# Altium project SoldeerBout.PrjPcb
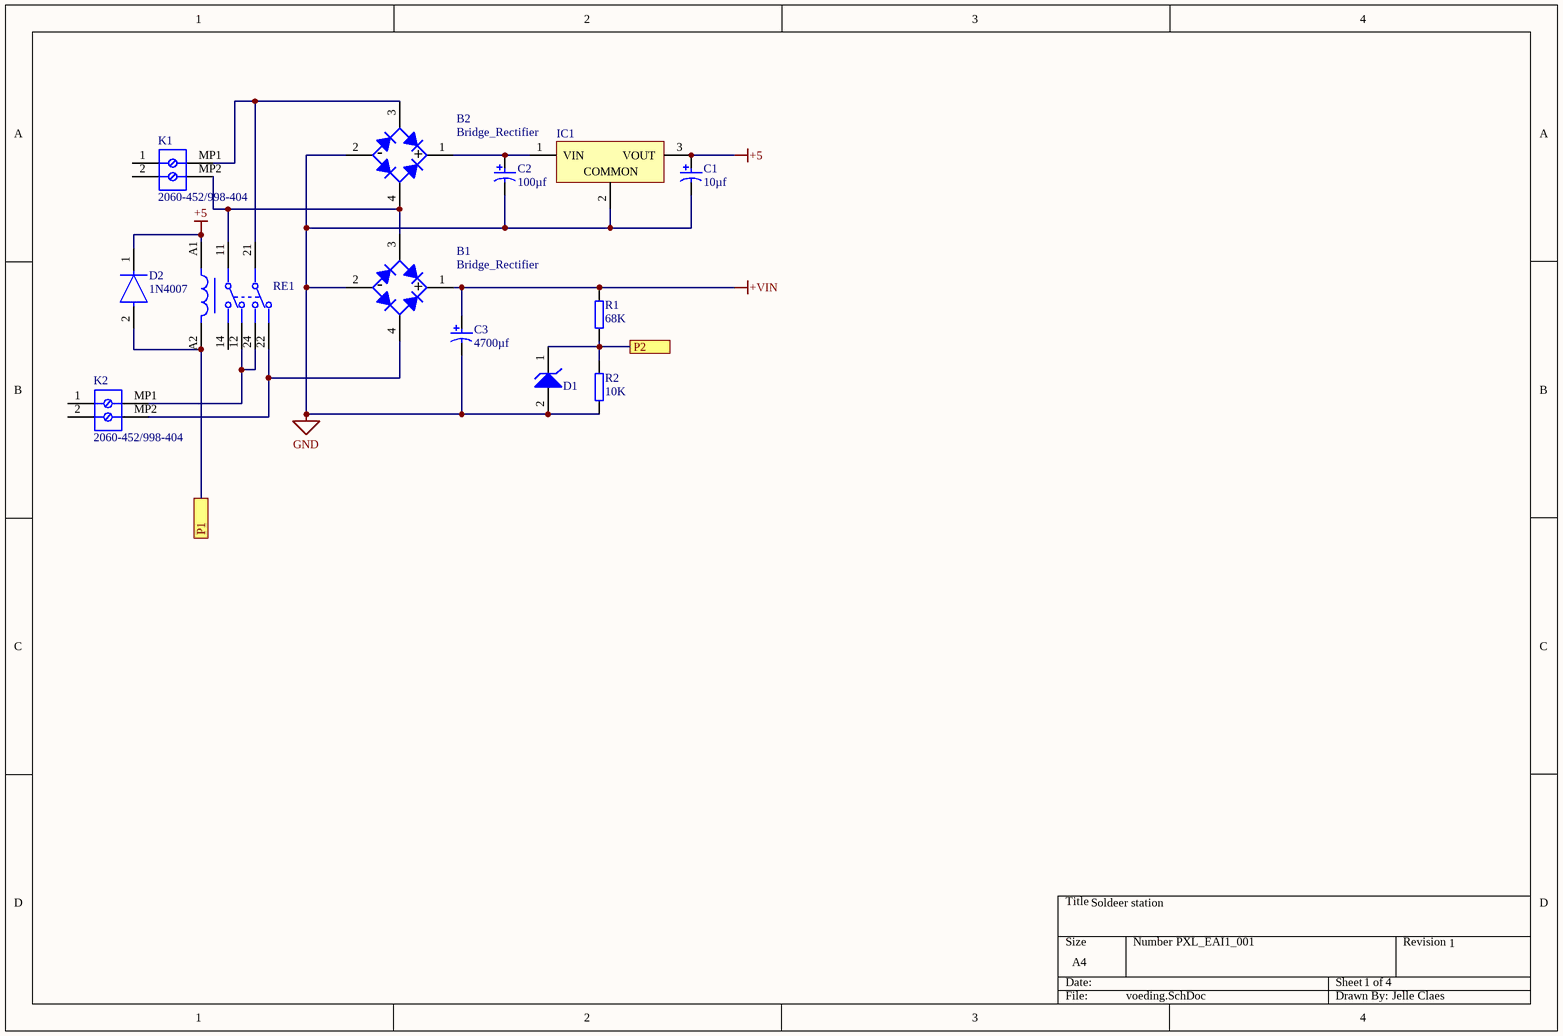
[diagram p0: voeding.SchDoc]
sheetof: =Sheet+'/'+SheetTotal
4 sheets, 64 parts. Net scope: flat (ports and power ports of the same name join across sheets).
Board file: soldeerstation.PcbDoc
Sheets:
  voeding.SchDoc
  PWM.SchDoc
  thermokoppel.SchDoc
  CPU.SchDoc

## Sheet voeding.SchDoc: Soldeer station
size A4; DrawnBy: Jelle Claes; SheetNumber: 1; SheetTotal: 4; Number: PXL_EAI1_001

### Parts
B1  Bridge_Rectifier  [ttf]
B2  Bridge_Rectifier  [ttf]
C1  10µf  [D4L5.4]
C2  100µf  [CE_D8_L10]
C3  4700µf  [CE_D25_L25_plugin]
D1  Zener_Diode  [SOD-123FL]  (value not drawn)
D2  1N4007  [SOD-123FL]
IC1  OKI-78SR-5/1.5-W36-C  [OKI78SR515W36C]  (value not drawn)
K1  2060-452/998-404  [WAGO-2060-452_V]
K2  2060-452/998-404  [WAGO-2060-452_V]
R1  68K  [R_0805_M]
R2  10K  [R_0805_M]
RE1  RELAY_GENERAL_PURPOSE  [RT42]  (value not drawn)

### Ports
P1 (see CPU[1A]), P2 (see CPU[3B])

### Nets
+5: C1.2 D2.1(C) IC1.3(VOUT) RE1.A1
+VIN: B1.1(K) C3.2 R1.2
GND: B1.2(A) B2.2(A) C1.1 C2.1 C3.1 D1.2(A) IC1.2(COMMON) R2.1
NetB1_3: B1.3(C) B2.4(C) K1.MP2 RE1.11
NetB1_4: B1.4(C) K2.MP2 RE1.22
NetB2_1: B2.1(K) C2.2 IC1.1(VIN)
NetB2_3: B2.3(C) K1.MP1 RE1.21
NetD1_1: D1.1(K) R1.1 R2.2 ; port P2
NetD2_2: D2.2(A) RE1.A2 ; port P1
NetK2_MP1: K2.MP1 RE1.12 RE1.24

Not connected (* = marked no-connect by the designer): K1 1 2; K2 1 2; RE1 14

### Notes on the sheet
- 1
- (in symbol Bridge_Rectifier) -; +

### Library data of the parts
B1 B2 = Bridge_Rectifier: Manufacturer: Diodes Inc; Average Rectified Current-Max: 0.8A; Reverse Voltage-Max [Vrrm]: 600V; Forward Voltage: 1V; Peak Current-Max: 30A; Reverse Current-Max: 5µA; Package Version: 05/2016; Package URL: http://www.diodes.com/_files/packages/MiniDIP.pdf; Datasheet Version: Rev. 13-2, 12/2010; Datasheet URL: http://www.diodes.com/_files/datasheets/ds17003.pdf; Mounting Technology: SurfaceMount; Manufacturer URL: http://www.diodes.com/; Package Reference: MiniDIP-4; Package Description: 4-Pin Small Outline Integrated Circuit, Body 4.7 x 3.8 mm, Pitch 2.5 mm
C1-C3 = Capacitor_Electrolytic: Manufacturer: Panasonic; Voltage Rating: 25 V; ComponentLink2URL: http://industrial.panasonic.com/cdbs/www-data/pdf/RDE0000/ABA0000C1181.pdf; Height: 10.2 mm; Max Operating Temperature: 105 degC; PackageReference: EEE-FK1E221P; ComponentLink1Description: Manufacturer URL; ComponentLink1URL: http://www.panasonic.com/; Mount: Surface Mount; REACH SVHC: No SVHC; Min Operating Temperature: -55 degC; ComponentLink2Description: Datasheet; DatasheetVersion: 03/2016; Length: 10.2 mm; RoHSCompliant: true; Packaging: Tape and Reel; Package Quantity: 500; Lead Pitch: 3.1 mm; Pins: 2; PackageDescription: 2-Pin Electrolytic Aluminum Capacitor, Body 8.3 x 8.3 mm; Mounting Technology: Surface Mount
D1 = Zener_Diode: Manufacturer: On Semiconductor; PartNumber: 1SMB5920BT3G; Packing: Tape and Reel; VZ Typ (V): 6.2; PackageDescription: 2-Pin Small Molded Package, J-Bend Lead, Body 4.33 x 3.625 mm; Mounting Technology: Surface Mount; PackageVersion: Rev. H, 05/2011; ComponentLink1Description: Manufacturer URL; RoHS: Pb-Free; DatasheetVersion: Rev. 8; ComponentLink2Description: Datasheet; ComponentLink2URL: http://www.onsemi.com/pub_link/Collateral/1SMB5913BT3-D.PDF; ComponentLink1URL: http://www.onsemi.com/; ComponentLink3Description: Package Specification; PackageReference: SMB-2-403A-03_H; ComponentLink3URL: http://www.onsemi.com/pub_link/Collateral/1SMB5913BT3-D.PDF
D2 = Diode: Manufacturer: Diotec; Max Surge Forward Current: 27A; Forward Current: 1A; Max Junction Temp: +175°C; Reverse Voltage: 1000V; Value: 15pF; Peak Reverse Current: 5uA; Category: Diode; Temperature Range Low: -50°C; Automotive: No; Temperature: -50°C to +175°C; Lead Free: Yes; ComponentLink2Description: Datasheet; Max Repetitive Reverse Voltage: 1000V; ComponentLink2URL: https://datasheet.octopart.com/1N4007-Diotec-datasheet-62346875.pdf; Manufacturer Part Number: 1N4007; Device Class L3: Rectifier Diodes; Height: 2.8mm; Octopart: https://octopart.com/1n4007-diotec-4040411; Package: 1N4007; Temperature Range High: +175°C; Device Class L1: Discrete Semiconductors; Device Class L2: Diodes; RoHS: TRUE; Capacitance: 15pF; Ipc Land Pattern Name: DIOAD888W100L520D280
IC1 = OKI-78SR-5/1.5-W36-C: Non-Isolated DC/DC Converter, 7.5 W, 7 to 36 V, 1.5 A, -40 to 85 degC, 3-Pin THD, RoHS; Manufacturer: Murata; Current - Output (Max): 1.5A; Power (Watts) - Max: 8W; Efficiency: 90.5%; Voltage - Input (Min): 7V; Voltage - Input (Max): 36V; Voltage - Output 1: 5V; Number of Outputs: 1; Package / Case: 3-SIPModule; Features: SCP; Type: LinearRegulatorReplacement; Size / Dimension: 0.41"Lx0.30"Wx0.65"H(10.4mmx7.6mmx16.5mm); Datasheet URL: https://datasheet.ciiva.com/8006/1790439-8006672.pdf; Datasheet Version: Oct-13; Power (Watts) - Manufacture Series: 8W; Voltage - Output 2: -; Series: Okami™OKI-78SR; Family: DCDCConverters; Manufacturer URL: http://www.murata.com/; Category: PowerSupplies-BoardMount; Voltage - Isolation: -; Packaging: Tube; Applications: ITE(Commercial); Mounting Type: ThroughHole; Voltage - Output 3: -; Operating Temperature: -40degC~85degC
K1 K2 = WAGO-2060: Terminal Block, Pitch 4 mm, 1 x 2 Position, Height 4.5 mm, -60 to 105 degC, RoHS, Tape and Reel; Manufacturer: WAGO; Number of contacts: 2; Content: 1pc(s); Min. cross section (flexible): 0.25mm²; Stripping length: 6-7mm; Nominal current: 9A; Nominal voltage: 160V; Pitch: 4mm; Min. cross section (unflexible): 0.2mm²; Max. cross section (inflexible): 0.75mm²; AWG: 24-18; Connection: Pullspring; Type: 2060-452/998-404; Package Reference: 2060-452; Mounting Technology: SurfaceMount; Colour: White; Package Description: Terminal Block, Pitch 4 mm, 1 x 2 Position, Height 4.5 mm; Height: 4.5mm; Manufacturer URL: http://global.wago.com/en/index-en.jsp; Material: PPA-GFenclosure·Tin-platedcoppercontacts; Width: 10.1mm; Manufacturer part No.: 2060-452/998-404; Datasheet URL: http://www.wago.com/infomaterial/pdf/60255126.pdf; Contact material: Tinplated; Length: 7.9mm; Max. cross section (flexible): 0.75mm²; Datasheet Version: 03/2015
R1 R2 = Resistor: Manufacturer: Vishay Dale; Part Number: CRCW08050000Z0EA
RE1 = RELAY_GENERAL_PURPOSE: Manufacturer Part Number: RT424005; Manufacturer: TE Connectivity; Coil Power: 403mW; Throw Configuration: DPDT; Coil Voltage: 5V; Number Of Contacts: 2; Coil Resistance: 62Ω; Current Rating: 8A; Coil Type: Non-Latching; Category: Relay; Octopart: https://octopart.com/5-1393243-9-te+connectivity-41835766; Device Class L3: Power Relays; ComponentLink2URL: https://www.te.com/commerce/DocumentDelivery/DDEController?Action=showdoc&DocId=Data+Sheet%7FRT2%7F1014%7Fpdf%7FEnglish%7FENG_DS_RT2_1014.pdf%7F5-1393243-9; Ambient Temperature Range High: +85°C; ComponentLink2Description: Datasheet; Digikey Description: RELAY GENERAL PURPOSE DPDT 8A 5V; Package: RT424005; Automotive: No; Device Class L1: Electromechanical; Height: 15.7mm; Device Class L2: Relays; Ambient Temperature Range Low: -40°C; Mouser Description: General Purpose Relay, Rt2 Series, Power, Non Latching, Dpdt, 5 Vdc, 8 A Rohs Compliant: Yes; Lead Free: Yes; RoHS: TRUE

## Sheet PWM.SchDoc
size A4; SheetNumber: 2; SheetTotal: 4
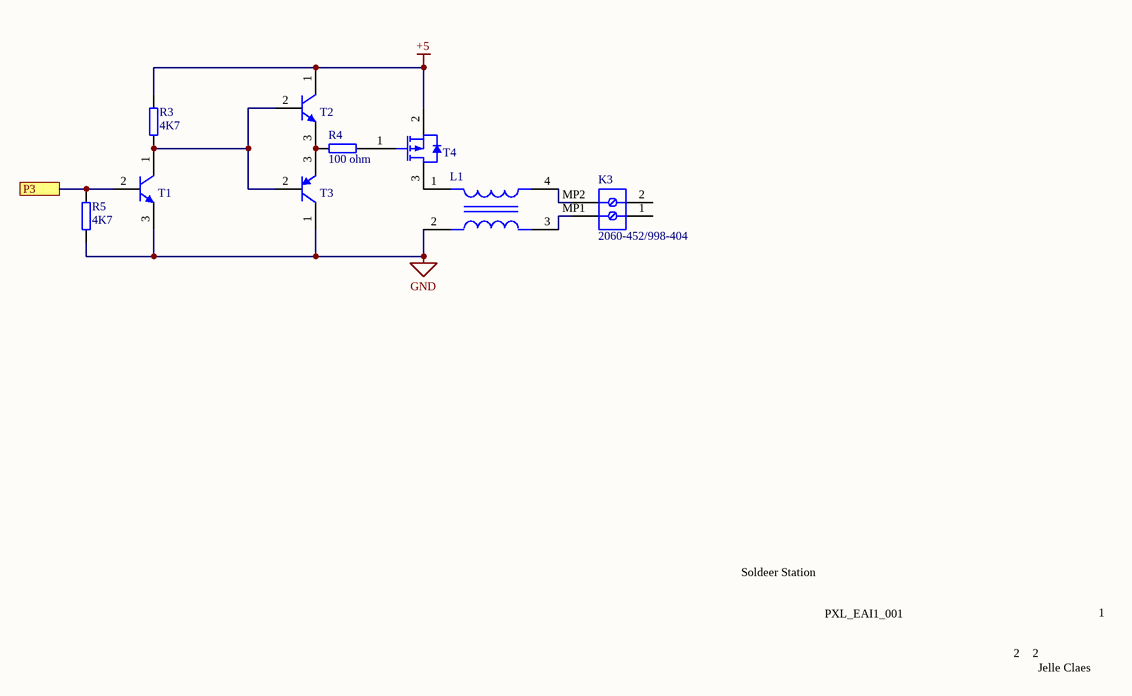
[diagram p1: PWM.SchDoc]

### Parts
K3  2060-452/998-404  [WAGO-2060-452_V]
L1  Common_Mode_Choke  [2545]  (value not drawn)
R3  4K7  [R_0805_M]
R4  100 ohm  [R_0805_M]
R5  4K7  [R_0805_M]
T1  Transistor_NPN  [SOT_23]  (value not drawn)
T2  Transistor_NPN  [SOT_23]  (value not drawn)
T3  Transistor_PNP  [SOT_23]  (value not drawn)
T4  MOSFET_P  [TO_252]  (value not drawn)

### Ports
P3 (see CPU[2B])

### Nets
+5: R3.2 T2.1(C) T4.2(DRAIN)
GND: L1.2 R5.1 T1.3(E) T3.1(C)
NetK3_MP1: K3.MP1 L1.3
NetK3_MP2: K3.MP2 L1.4
NetL1_1: L1.1 T4.3(SOURCE)
NetR3_1: R3.1 T1.1(C) T2.2(B) T3.2(B)
NetR4_1: R4.1 T4.1(GATE)
NetR4_2: R4.2 T2.3(E) T3.3(E)
NetR5_2: R5.2 T1.2(B) ; port P3

Not connected (* = marked no-connect by the designer): K3 1 2

### Notes on the sheet
- Soldeer Station
- PXL_EAI1_001
- 2
- 1
- Jelle Claes

### Library data of the parts
K3 = WAGO-2060: as K1 on sheet voeding; Type: 2060-452/998-404; Package Reference: 2060-452; Mounting Technology: SurfaceMount; Colour: White; Package Description: Terminal Block, Pitch 4 mm, 1 x 2 Position, Height 4.5 mm; Height: 4.5mm; Manufacturer URL: http://global.wago.com/en/index-en.jsp; Material: PPA-GFenclosure·Tin-platedcoppercontacts; Width: 10.1mm; Manufacturer part No.: 2060-452/998-404; Datasheet URL: http://www.wago.com/infomaterial/pdf/60255126.pdf; Contact material: Tinplated; Length: 7.9mm; Max. cross section (flexible): 0.75mm²; Datasheet Version: 03/2015
L1 = Common_Mode_Choke: Max Current Rating: 2A; Number of Lines: 2; Impedance: 900R; Element Configuration: Dual; Insulation Resistance: 10MR; Test Frequency: 100MHz; DC Resistance (DCR): 60mR; Voltage Rating (DC): 50V; Current Rating: 2.3A; Number of Pins: 4; DC Current: 2A; Mount: Surface Mount; Current: 2A; REACH SVHC: No SVHC; Width: 4.5mm; Case/Package: 1808; Voltage Rating: 50V; Package Quantity: 1; Height: 2mm; Max DC Current: 2A; Packaging: Tape and Reel; Max Operating Temperature: 85°C; Lead Free: Lead Free; Length: 0.185inch; Series: ACM; Radiation Hardening: No; Max Voltage Rating (DC): 50V; Termination: Flat; Depth: 4.7mm; RoHS Compliant: Yes; DC Resistance-Max: 60mR; Min Operating Temperature: -40°C
R3-R5 = Resistor: as R1 on sheet voeding
T1 T2 = Transistor_NPN: Manufacturer: On Semiconductor; PartNumber: BC547C; IC Continuous (A): 0.1; fT Min (MHz): 150; Packing: Bulk Box; Polarity: NPN; Mounting Technology: Through Hole; ComponentLink1URL: http://www.onsemi.com/; ComponentLink1Description: Manufacturer URL; ComponentLink3URL: http://www.onsemi.cn/pub_link/Collateral/2N6426-D.PDF; DatasheetVersion: Rev. 7; PackageVersion: Rev. AM; RoHS: FALSE; ComponentLink2URL: http://www.onsemi.com/pub_link/Collateral/BC546-D.PDF; ComponentLink3Description: Package Specification; PackageDescription: 3-Pin Transistor Outline, Body 4.825 x 3.685 mm, Pitch 1.27 mm; PackageReference: TO-92-3-29-11_AM_SL; ComponentLink2Description: Datasheet
T3 = Transistor_PNP: Manufacturer: On Semiconductor; PartNumber: BC557C; Polarity: PNP; IC Continuous (A): -0.1; Packing: Bulk Box; PackageVersion: Rev. AM; RoHS: FALSE; PackageDescription: 3-Pin Transistor Outline, Body 4.825 x 3.685 mm, Pitch 1.27 mm; ComponentLink2Description: Datasheet; DatasheetVersion: Rev. 3; ComponentLink3Description: Package Specification; Mounting Technology: Through Hole; ComponentLink2URL: http://www.onsemi.com/pub_link/Collateral/BC556B-D.PDF; ComponentLink1URL: http://www.onsemi.com/; ComponentLink1Description: Manufacturer URL; ComponentLink3URL: http://www.onsemi.cn/pub_link/Collateral/2N6426-D.PDF; PackageReference: TO-92-3-29-11_AM_SL
T4 = MOSFET_P: Manufacturer: Fairchild Semiconductor; Reel Quantity: 3000; Drain Source Voltage Vds: 20V; Power Dissipation Pd: 500mW; On Resistance Rds(on): 52mohm; Full Power Rating Temperature: 25°C; Voltage Vgs Max: -800mV; Pulse Current Idm: 10A; Rds(on) Test Voltage Vgs: -4.5V; External Depth: 2.5mm; Transistor Case Style: SOT-23; No. of Pins: 3; Continuous Drain Current Id: 2.4A; Voltage Vds Typ: -20V; Voltage Vgs th Max: -1.5V; Transistor Polarity: PChannel; Package Version: Rev. 3, 05/2015; External Width: 3.05mm; External Length / Height: 1.12mm; SMD Marking: 304P; SVHC: NoSVHC(19-Dec-2012); Termination Type: SMD; Datasheet URL: https://www.fairchildsemi.com/datasheets/FD/FDN304P.pdf; Tape Width: 8mm; Mounting Technology: SurfaceMount; Voltage Vgs Rds on Measurement: -4.5V; Operating Temperature Range: -55°Cto+150°C; Current Temperature: 25°C; Operating Temperature Min: -55°C; Threshold Voltage Vgs Typ: -800mV; Package / Case: SOT-23; Manufacturer URL: https://www.fairchildsemi.com/; Voltage Vds: 20V; Datasheet Version: Rev. C, 01/2001; Operating Temperature Max: 150°C; Package Description: 3-Pin Small Outline Transistor, Body 2.92 x 1.4 mm, Pitch 0.95 mm; Current Id Max: 2.4A; Package URL: https://www.fairchildsemi.com/package-drawings/MA/MA03B.pdf; Package Reference: SSOT3L

## Sheet thermokoppel.SchDoc: Thermokoppel
size A4; DrawnBy: Jelle Claes; SheetNumber: 3; SheetTotal: 4
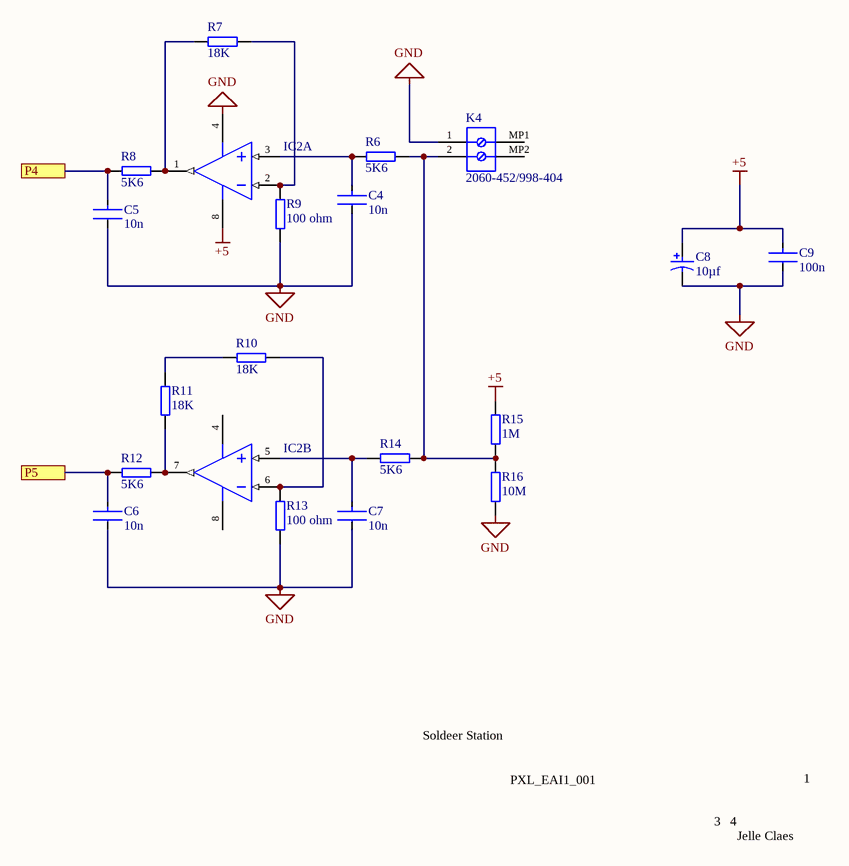
[diagram p2: thermokoppel.SchDoc]

### Parts
C4  10n  [CC_0805_m]
C5  10n  [CC_0805_m]
C6  10n  [CC_0805_m]
C7  10n  [CC_0805_m]
C8  10µf  [CE_D8_L10]
C9  100n  [CC_0805_m]
IC2  Dual_Opamp  [MSOP_8_M]  (value not drawn)  (parts A,B of 2)
K4  2060-452/998-404  [WAGO-2060-452_V]
R6  5K6  [R_0805_M]
R7  18K  [R_0805_M]
R8  5K6  [R_0805_M]
R9  100 ohm  [R_0805_M]
R10  18K  [R_0805_M]
R11  18K  [R_0805_M]
R12  5K6  [R_0805_M]
R13  100 ohm  [R_0805_M]
R14  5K6  [R_0805_M]
R15  1M  [R_0805_M]
R16  10M  [R_0805_M]

### Ports
P4 (see CPU[3B]), P5 (see CPU[3B])

### Nets
+5: C8.2 C9.1 IC2.8(VDD) R15.2
GND: C4.2 C5.2 C6.2 C7.2 C8.1 C9.2 IC2.4(VSS) K4.1 R9.2 R13.2 R16.1
NetC4_1: C4.1 IC2.3(VINA+) R6.1
NetC5_1: C5.1 R8.1 ; port P4
NetC6_1: C6.1 R12.2 ; port P5
NetC7_1: C7.1 IC2.5(VINB+) R14.1
NetIC2_1: IC2.1(VOUTA) R7.1 R8.2
NetIC2_2: IC2.2(VINA-) R7.2 R9.1
NetIC2_6: IC2.6(VINB-) R10.2 R13.1
NetIC2_7: IC2.7(VOUTB) R11.1 R12.1
NetK4_2: K4.2 R6.2 R14.2 R15.1 R16.2
NetR10_1: R10.1 R11.2

Not connected (* = marked no-connect by the designer): K4 MP1 MP2

### Notes on the sheet
- Soldeer Station
- PXL_EAI1_001
- 3
- 4
- 1
- Jelle Claes

### Library data of the parts
C4-C7 C9 = Capacitor_Ceramic: Manufacturer: KEMET; Manufacturer Part Number: C0805C224K5RACTU; Value: 0.22 μF; Temperature Characteristic: X7R; Temperature Coefficient: 30ppm/°C; Tolerance: 0.1; Voltage Rating: 50 V; ComponentLink2URL: https://content.kemet.com/datasheets/KEM_C1003_C0G_SMD.pdf; Device Class L3: Ceramic Capacitors; Lead Free: Yes; Temperature: -55°C to +125°C; RoHS: TRUE; Capacitance: 0.22 μF; Automotive: No; Material: Ceramic; Octopart: https://octopart.com/c0805c224k5ractu-kemet-144670; Temperature Range Low: -55°C; Height: 0.88mm; Device Class L1: Passive Components; Digikey Description: CAP CER 0.22UF 50V X7R 0805; ComponentLink2Description: Datasheet; Mouser Description: CAP CER 0.22UF 50V X7R 0805; Category: Cap; Ipc Land Pattern Name: CAPC200125X78; Temperature Range High: +125°C; Package: C0805C-DN; Device Class L2: Capacitors
C8 = Capacitor_Electrolytic: as C1 on sheet voeding; ComponentLink2URL: http://industrial.panasonic.com/cdbs/www-data/pdf/RDE0000/ABA0000C1181.pdf; Height: 10.2 mm; Max Operating Temperature: 105 degC; PackageReference: EEE-FK1E221P; ComponentLink1Description: Manufacturer URL; ComponentLink1URL: http://www.panasonic.com/; Mount: Surface Mount; REACH SVHC: No SVHC; Min Operating Temperature: -55 degC; ComponentLink2Description: Datasheet; DatasheetVersion: 03/2016; Length: 10.2 mm; RoHSCompliant: true; Packaging: Tape and Reel; Package Quantity: 500; Lead Pitch: 3.1 mm; Pins: 2; PackageDescription: 2-Pin Electrolytic Aluminum Capacitor, Body 8.3 x 8.3 mm; Mounting Technology: Surface Mount
IC2 = Dual_Opamp: Slew Rate: 0.6V/µs; Supply Current: 100uA; Power Supply Rejection Ratio (PSRR): 86dB; Input Offset Voltage (Vos): 4.5mV; Input Bias Current: 1pA; Amplifier Type: GENERAL PURPOSE; Unity Gain Bandwidth Product: 1MHz; Number of Circuits: 2; Output Current: 23mA; Operating Supply Voltage: 5.5V; Min Supply Voltage: 1.8V; Common Mode Rejection Ratio: 60dB; Voltage Gain: 112dB; Max Supply Voltage: 6V; Package Quantity: 60; REACH SVHC: No SVHC; Min Operating Temperature: -40°C; Max Operating Temperature: 125°C; Mount: Through Hole; Nominal Supply Current: 100uA; Height: 3.3mm; Length: 9.27mm; Slew Rate-Nom: 0.6V/µs; Packaging: Rail/Tube; Output Current per Channel: 23mA; Number of Amplifiers: 2; RoHS Compliant: Yes; Radiation Hardening: No; Bandwidth: 1MHz; Lead Free: Lead Free; Width: 6.35mm; Number of Channels: 2; Gain Bandwidth Product: 1MHz; Technology: CMOS; Operating Supply Current: 100uA; Number of Elements: 2; Number of Pins: 8; Input Offset Voltage-Max: 4.5mV; Case/Package: PDIP
K4 = WAGO-2060: as K1 on sheet voeding; Type: 2060-452/998-404; Package Reference: 2060-452; Mounting Technology: SurfaceMount; Colour: White; Package Description: Terminal Block, Pitch 4 mm, 1 x 2 Position, Height 4.5 mm; Height: 4.5mm; Manufacturer URL: http://global.wago.com/en/index-en.jsp; Material: PPA-GFenclosure·Tin-platedcoppercontacts; Width: 10.1mm; Manufacturer part No.: 2060-452/998-404; Datasheet URL: http://www.wago.com/infomaterial/pdf/60255126.pdf; Contact material: Tinplated; Length: 7.9mm; Max. cross section (flexible): 0.75mm²; Datasheet Version: 03/2015
R6-R16 = Resistor: as R1 on sheet voeding

## Sheet CPU.SchDoc
size A4; SheetNumber: 4; SheetTotal: 4
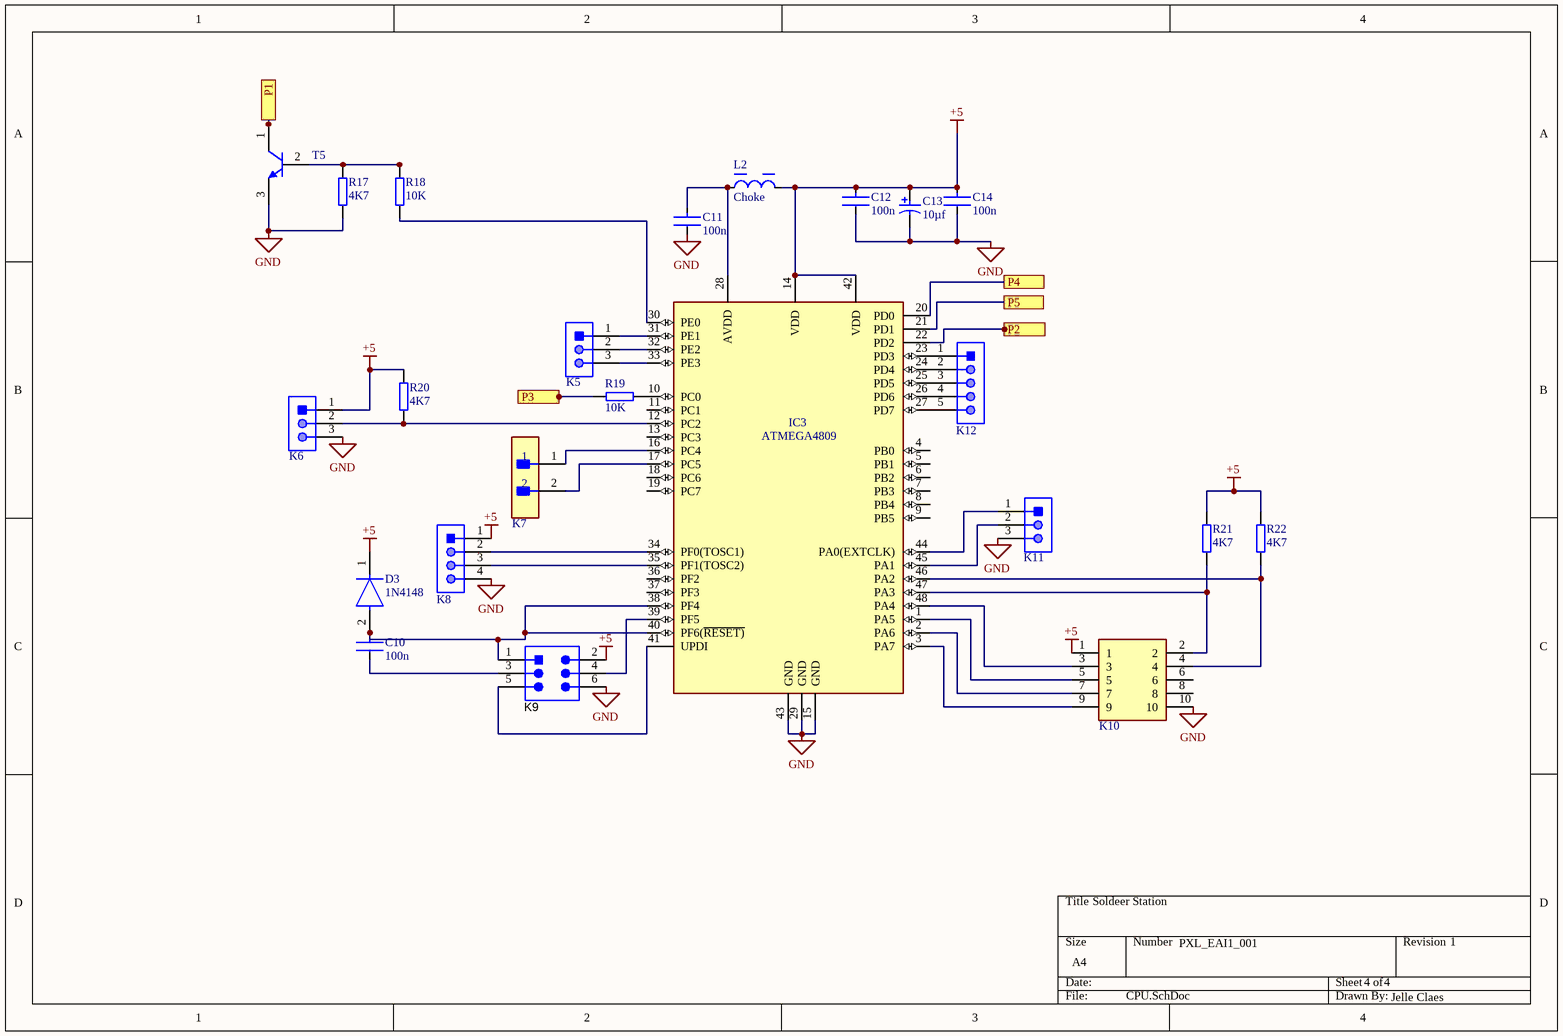
[diagram p3: CPU.SchDoc]

### Parts
C10  100n  [CC_0805_m]
C11  100n  [CC_0805_m]
C12  100n  [CC_0805_L]
C13  10µf  [D4L5.4]
C14  100n  [CC_0805_L]
D3  1N4148  [SOD-123FL]
IC3  ATMEGA4809  [TQFP_48_M]
K5  22-28-4033  [MOLX-22-28-4033_V]  (value not drawn)
K6  22-28-4033  [MOLX-22-28-4033_V]  (value not drawn)
K7  M22-2510205  [FP-M22-2510205-MFG]  (value not drawn)
K8  61300411121  [61300411121]  (value not drawn)
K9  TSW-103-07-G-D  [SMTC-TSW-103-07-G-D_V]  (value not drawn)
K10  5x2 box pinheader  [2x5 box pinheader]  (value not drawn)
K11  22-28-4033  [MOLX-22-28-4033_V]  (value not drawn)
K12  61300511121  [61300511121]  (value not drawn)
L2  Choke  [CC_0805_L]
R17  4K7  [R_0805_M]
R18  10K  [R_0805_M]
R19  10K  [R_0805_M]
R20  4K7  [R_0805_M]
R21  4K7  [R_0805_M]
R22  4K7  [R_0805_M]
T5  Transistor_NPN  [SOT_23]  (value not drawn)

### Ports
P1 (see voeding[1C]), P2 (see voeding[2B]), P3 (see PWM[1C]), P4 (see thermokoppel[2B]), P5 (see thermokoppel[2C])

### Nets
+5: C12.1 C13.2 C14.1 D3.1(C) IC3.14(VDD) IC3.42(VDD) K6.1 K8.1 K9.2 K10.1 L2.2 R20.2 R21.2 R22.2
GND: C11.2 C12.2 C13.1 C14.2 IC3.15(GND) IC3.29(GND) IC3.43(GND) K6.3 K8.4 K9.6 K10.10 K11.3 R17.1 T5.3(E)
NetC5_1: IC3.20(PD0) ; port P4
NetC6_1: IC3.21(PD1) ; port P5
NetC10_1: C10.1 D3.2(A) IC3.38(PF4) IC3.40(PF6(~{RESET)}) K9.1
NetC10_2: C10.2 K9.3
NetC11_1: C11.1 IC3.28(AVDD) L2.1
NetD1_1: IC3.22(PD2) ; port P2
NetD2_2: T5.1(C) ; port P1
NetIC3_1: IC3.1(PA5) K10.5
NetIC3_2: IC3.2(PA6) K10.7
NetIC3_3: IC3.3(PA7) K10.9
NetIC3_10: IC3.10(PC0) R19.2
NetIC3_12: IC3.12(PC2) K6.2 R20.1
NetIC3_16: IC3.16(PC4) K7.1
NetIC3_17: IC3.17(PC5) K7.2
NetIC3_23: IC3.23(PD3) K12.1
NetIC3_24: IC3.24(PD4) K12.2
NetIC3_25: IC3.25(PD5) K12.3
NetIC3_26: IC3.26(PD6) K12.4
NetIC3_27: IC3.27(PD7) K12.5
NetIC3_30: IC3.30(PE0) R18.1
NetIC3_31: IC3.31(PE1) K5.1
NetIC3_32: IC3.32(PE2) K5.2
NetIC3_33: IC3.33(PE3) K5.3
NetIC3_34: IC3.34(PF0(TOSC1)) K8.2
NetIC3_35: IC3.35(PF1(TOSC2)) K8.3
NetIC3_39: IC3.39(PF5) K9.4
NetIC3_41: IC3.41(UPDI) K9.5
NetIC3_44: IC3.44(PA0(EXTCLK)) K11.1
NetIC3_45: IC3.45(PA1) K11.2
NetIC3_46: IC3.46(PA2) K10.4 R22.1
NetIC3_47: IC3.47(PA3) K10.2 R21.1
NetIC3_48: IC3.48(PA4) K10.3
NetR5_2: R19.1 ; port P3
NetR17_2: R17.2 R18.2 T5.2(B)

Not connected (* = marked no-connect by the designer): IC3 4(PB0) 5(PB1) 6(PB2) 7(PB3) 8(PB4) 9(PB5) 11(PC1) 13(PC3) 18(PC6) 19(PC7) 36(PF2) 37(PF3); K10 6 8

### Notes on the sheet
- Soldeer Station
- PXL_EAI1_001
- 4
- 1
- Jelle Claes

### Library data of the parts
C10-C12 C14 = Capacitor_Ceramic: as C4 on sheet thermokoppel; ComponentLink2URL: https://content.kemet.com/datasheets/KEM_C1003_C0G_SMD.pdf; Device Class L3: Ceramic Capacitors; Lead Free: Yes; Temperature: -55°C to +125°C; RoHS: TRUE; Capacitance: 0.22 μF; Automotive: No; Material: Ceramic; Octopart: https://octopart.com/c0805c224k5ractu-kemet-144670; Temperature Range Low: -55°C; Height: 0.88mm; Device Class L1: Passive Components; Digikey Description: CAP CER 0.22UF 50V X7R 0805; ComponentLink2Description: Datasheet; Mouser Description: CAP CER 0.22UF 50V X7R 0805; Category: Cap; Ipc Land Pattern Name: CAPC200125X78; Temperature Range High: +125°C; Package: C0805C-DN; Device Class L2: Capacitors
C13 = Capacitor_Electrolytic: as C1 on sheet voeding; ComponentLink2URL: http://industrial.panasonic.com/cdbs/www-data/pdf/RDE0000/ABA0000C1181.pdf; Height: 10.2 mm; Max Operating Temperature: 105 degC; PackageReference: EEE-FK1E221P; ComponentLink1Description: Manufacturer URL; ComponentLink1URL: http://www.panasonic.com/; Mount: Surface Mount; REACH SVHC: No SVHC; Min Operating Temperature: -55 degC; ComponentLink2Description: Datasheet; DatasheetVersion: 03/2016; Length: 10.2 mm; RoHSCompliant: true; Packaging: Tape and Reel; Package Quantity: 500; Lead Pitch: 3.1 mm; Pins: 2; PackageDescription: 2-Pin Electrolytic Aluminum Capacitor, Body 8.3 x 8.3 mm; Mounting Technology: Surface Mount
D3 = Diode: Manufacturer Part Number: 1N4007; Manufacturer: Diotec; Max Surge Forward Current: 27A; Forward Current: 1A; Max Junction Temp: +175°C; Reverse Voltage: 1000V; Value: 15pF; Peak Reverse Current: 5uA; Category: Diode; Temperature Range Low: -50°C; Automotive: No; Temperature: -50°C to +175°C; Lead Free: Yes; ComponentLink2Description: Datasheet; Max Repetitive Reverse Voltage: 1000V; ComponentLink2URL: https://datasheet.octopart.com/1N4007-Diotec-datasheet-62346875.pdf; Device Class L3: Rectifier Diodes; Height: 2.8mm; Octopart: https://octopart.com/1n4007-diotec-4040411; Package: 1N4007; Temperature Range High: +175°C; Device Class L1: Discrete Semiconductors; Device Class L2: Diodes; RoHS: TRUE; Capacitance: 15pF; Ipc Land Pattern Name: DIOAD888W100L520D280
IC3 = ATMEGA4809: Peripherals: Brown-out Detect/Reset; Number of I/Os: 41; Core Architecture: AVR; Memory Size: 48KB; Interface: I2C; Oscillator Type: Internal; Memory Type: FLASH; Series: megaAVR® 0, Functional Safety (FuSa); Min Operating Temperature: -40°C; Mount: Surface Mount; Case/Package: TQFP; RoHS Compliant: Yes; Max Operating Temperature: 85°C
K5 K6 K11 = CMP-1676-00001-5: Male Header, Pitch 2.54 mm, 1 x 3 Position, Height 8.38 mm, Tail Length 3.18 mm, RoHS, Bulk; Manufacturer: Molex; Rows: 1; Voltage Rating: 250 V; Current Rating: 4 A; Min Operating Temperature: 0 degC; Lead Pitch: 0.1 inch; Packaging: Bulk; Contact Finish: Gold; RoHSCompliant: true; Contact Material: Brass; PackageReference: 22-28-4033; REACH SVHC: Unknown; PackageDescription: Male Header, Pitch 2.54 mm, 1 x 3 Position, Height 8.38 mm, Tail Length 3.18 mm; ComponentLink2URL: http://www.molex.com/pdm_docs/sd/022284033_sd.pdf; Height: 8.38 mm; Mounting Technology: Through Hole; ComponentLink1Description: Manufacturer URL; Length: 7.62 mm; Mount: Through Hole; DatasheetVersion: Rev. G, 01/2012; Max Operating Temperature: 75 degC; ComponentLink2Description: Datasheet; Colour: Black; Pins: 3; Contact Plating: Gold; Package Quantity: 1; ComponentLink1URL: http://www.molex.com/
K7 = CMP-15831-000005-1: CONN HEADER VERT 2POS 2MM; Manufacturer: Harwin; Conn Gender: Male; Current Rating: 2A; Number Of Contacts: 2; Conn Orientation: Vertical; Temperature Range Low: -40°C; Device Class L1: Connectors; ComponentLink2URL: https://cdn.harwin.com/pdfs/C018XX_M22_Series_Connectors.pdf; Temperature Range High: +105°C; Pitch: 2mm; Number Of Rows: 1; Temperature: -40°C to +105°C; Automotive: No; Device Class L3: unset; Octopart: https://octopart.com/m22-2510205-harwin-2538221; Mouser Description: Headers & Wire Housings 2 PIN SIL VERTICAL GOLD PIN HEADER; Height: 5.45mm; Category: Conn; Digikey Description: CONN HEADER VERT 2POS 2MM; Contact Material: Gold,Nickel; Lead Free: Yes; ComponentLink2Description: Datasheet; Manufacturer Part Number: M22-2510205; Device Class L2: Headers and Wire Housings; Package: 0; Footprint Url: https://cdn.harwin.com/pdfs/M22-251.pdf; RoHS: TRUE
K8 = CMP-1502-01064-1: THT Vertical Pin Header WR-PHD, Pitch 2.54 mm, Single Row, 4 pins; Manufacturer: Wurth Elektronik; Withstanding Voltage: 500VAC; Rated Current: 3A; Working Voltage: 250VAC; Pin Number: 4; Gender: Male; Contact Resistance: 20mOhm; Pitch: 2.54mm; Manufacturer URL: http://www.we-online.de; Operating Temperature: -40to105degC; Packaging: Bag; Mounting Technology: THT; Package Reference: 61300411121; Datasheet URL: https://katalog.we-online.de/em/datasheet/6130xx11121.pdf; Publisher: WurthElektronik; Part Number: 61300411121; Row Number: Single; Orientation: Vertical
K9 = CMP-2000-07329-1: Through Hole Header, Pitch 2.54 mm, 2 x 3 Position, Height 8.58 mm, Tail Length 2.54 mm, -55 to 125 degC, RoHS, Bulk; Manufacturer: Samtec-Inc.; Number of Positions Loaded: All; Number of Positions: 6; Row Spacing: 0.100"(2.54mm); Connector Type: Header,Unshrouded; Package Reference: TSW-103-07-G-D; Termination: Solder; Manufacturer URL: http://www.samtec.com/; Contact Finish: Gold; Contact Mating Length: 0.230"(5.84mm); Package Description: Through Hole Header, Pitch 2.54 mm, 2 x 3 Position, Height 8.58 mm, Tail Length 2.54 mm; Datasheet Version: 12/2015; Number of Rows: 2; Features: -; Family: RectangularConnectors-Headers,MalePins; Fastening Type: -; Datasheet URL: http://suddendocs.samtec.com/catalog_english/tsw_th.pdf; Category: Connectors,Interconnects; Package URL: http://suddendocs.samtec.com/prints/tsw-xxx-xx-xxx-x-xx-xxx-mkt.pdf; Mounting Type: ThroughHole; Contact Finish Thickness: 10µin(0.25µm); Packaging: Bulk; Color: Black; Pitch: 0.100"(2.54mm); Series: TSW; Contact Type: MalePin; Mounting Technology: ThroughHole
K10 = 5x2 box pinheader: Connector; Manufacturer_Name: Amphenol; Manufacturer_Part_Number: T821110A1S100CEU; Datasheet Link: https://docs.rs-online.com/e09c/0900766b81359cba.pdf; Height: 9.15mm; Mouser Part Number: N/A; Mouser Price/Stock: https://www.mouser.co.uk/ProductDetail/Amphenol/T821110A1S100CEU?qs=3IN%252Br8p6BrNf%2FuKCWm44Bg%3D%3D; Arrow Part Number: T821110A1S100CEU; Arrow Price/Stock: https://www.arrow.com/en/products/t821110a1s100ceu/amphenol-fci?region=europe
K12 = 5pin: THT Vertical Pin Header WR-PHD, Pitch 2.54 mm, Single Row, 5 pins; Manufacturer: Wurth Elektronik; Pin Number: 5; Contact Resistance: 20mOhm; Working Voltage: 250VAC; Pitch: 2.54mm; Withstanding Voltage: 500VAC; Rated Current: 3A; Gender: Male; Datasheet URL: https://katalog.we-online.de/em/datasheet/6130xx11121.pdf; Orientation: Vertical; Mounting Technology: THT; Row Number: Single; Package Reference: 61300511121; Publisher: WurthElektronik; Part Number: 61300511121; Packaging: Bag; Manufacturer URL: http://www.we-online.de; Operating Temperature: -40to105degC
L2 = Choke: Tolerance: 20%; Shielding: Shielded; Saturation Current: 10A; Test Frequency: 100kHz; RMS Current (Irms): 8.5A; Inductance: 10uH; Series Resistance: 14.1R; DC Resistance (DCR): 14.1mR; Self Resonant Frequency: 18MHz; Ratings: AEC-Q200; Width: 12.8mm; Series: WE-HCI; Length: 0.512inch; Mount: Surface Mount; Resistor Type: Wirewound; RoHS Compliant: Yes; Package Quantity: 1; Min Operating Temperature: -40°C; Inductance Tolerance: 20%; Termination: SMD/SMT; Max DC Current: 8.5A; Height - Seated (Max): 0.197inch; Case/Package: 1350; Current Rating: 8.5A; Max Operating Temperature: 155°C; Packaging: Tape and Reel; Height: 4.7mm
R17-R22 = Resistor: as R1 on sheet voeding
T5 = Transistor_NPN: as T1 on sheet PWM; Mounting Technology: Through Hole; ComponentLink1URL: http://www.onsemi.com/; ComponentLink1Description: Manufacturer URL; ComponentLink3URL: http://www.onsemi.cn/pub_link/Collateral/2N6426-D.PDF; DatasheetVersion: Rev. 7; PackageVersion: Rev. AM; RoHS: FALSE; ComponentLink2URL: http://www.onsemi.com/pub_link/Collateral/BC546-D.PDF; ComponentLink3Description: Package Specification; PackageDescription: 3-Pin Transistor Outline, Body 4.825 x 3.685 mm, Pitch 1.27 mm; PackageReference: TO-92-3-29-11_AM_SL; ComponentLink2Description: Datasheet

## Nets that join several sheets
+5: voeding (C1.2 D2.1 IC1.3 RE1.A1), PWM (R3.2 T2.1 T4.2), thermokoppel (C8.2 C9.1 IC2.8 R15.2), CPU (14 pins)
GND: voeding (8 pins), PWM (L1.2 R5.1 T1.3 T3.1), thermokoppel (11 pins), CPU (14 pins)
NetC5_1: thermokoppel (C5.1 R8.1), CPU (IC3.20)
NetC6_1: thermokoppel (C6.1 R12.2), CPU (IC3.21)
NetD1_1: voeding (D1.1 R1.1 R2.2), CPU (IC3.22)
NetD2_2: voeding (D2.2 RE1.A2), CPU (T5.1)
NetR5_2: PWM (R5.2 T1.2), CPU (R19.1)